# Altium schematic sheet milliohm-adapter.SchDoc
size A4; SheetNumber: 1; SheetTotal: 1
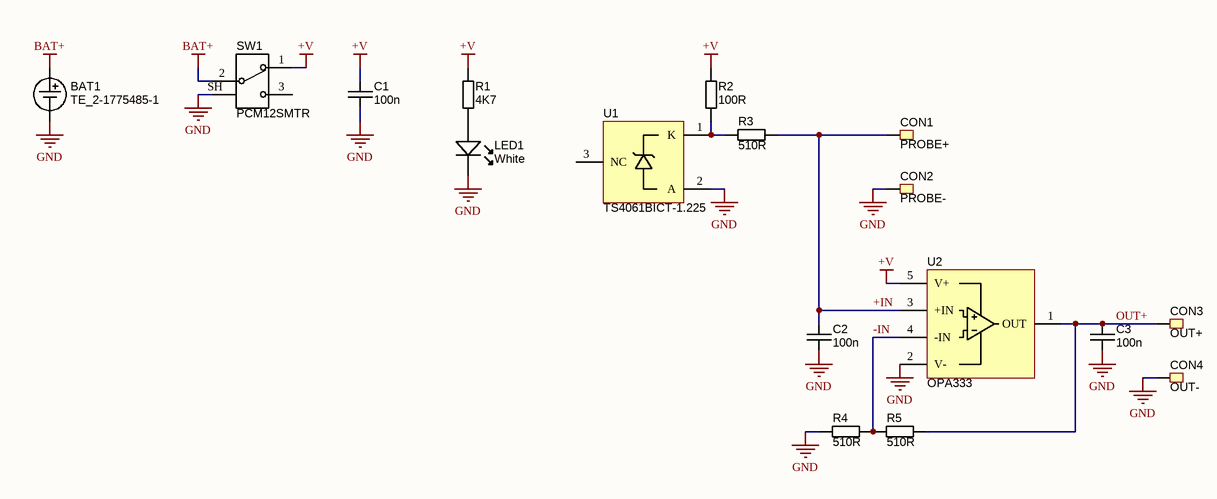
[diagram p0: milliohm-adapter.SchDoc]

## Parts
BAT1  TE_2-1775485-1  [TE_2-1775485-1]
C1  value 100n  [CAPC1608X90N]  (hidden comment: approved sub OK)
C2  value 100n  [CAPC1608X90N]  (hidden comment: approved sub OK)
C3  value 100n  [CAPC1608X90N]  (hidden comment: approved sub OK)
CON1  PROBE+  [AMASS-GC4010-F-THT]
CON2  PROBE-  [AMASS-GC4010-F-THT]
CON3  OUT+  [AMASS-GC4010-M-THT]
CON4  OUT-  [AMASS-GC4010-M-THT]
LED1  White  [LED-0603-WHITE]
R1  value 4K7  [RESC1608X55N]  (hidden comment: Thick Film)
R2  value 100R  [RESC1608X55N]  (hidden comment: Thick Film)
R3  value 510R  [RESC2012X70N]  (hidden comment: Thick Film)
R4  value 510R  [RESC2012X70N]  (hidden comment: Thick Film)
R5  value 510R  [RESC2012X70N]  (hidden comment: Thick Film)
SW1  PCM12SMTR  [PCM12SMTR]
U1  TS4061BICT-1.225  [TS4061_SOT323-3L]
U2  OPA333  [TI_DBV0005A_SOT23-5]

## Nets
+V: C1.1 R1.1 R2.2 SW1.1 U2.5(V+)
BAT+: BAT1.plus SW1.2
GND: BAT1.minus C1.2 C2.2 C3.2 CON2.1 CON4.1 LED1.K R4.2 SW1.SH U1.2(A) U2.2(V-)
+IN: C2.1 CON1.1 R3.1 U2.3(+IN)
-IN: R4.1 R5.2 U2.4(-IN)
OUT+: C3.1 CON3.1 R5.1 U2.1(OUT)
NetLED1_A: LED1.A R1.2
NetR2_1: R2.1 R3.2 U1.1(K)

Not connected (* = marked no-connect by the designer): SW1 3; U1 3(NC)

## Library data of the parts
C1-C3 = CAPC_100n_0603_X7R_50V_10%: Capacitor SMD Cer 100nF 10% 50V X7R 0603; Manufacturer 1: AVX Corporation; Manufacturer Part Number 1: 06035C104KAT2A; Ratings: 50V; X7R; Material: ceramic; SCDType: spec; Manufacturer 2: TDK Corporation; Manufacturer Part Number 2: C1608X7R1H104K; Package / Case: 0603 (1608 Metric); Tolerance: ±10%; Supplier 1: Digi-Key; Supplier Part Number 1: 478-5052-1-ND; ComponentLink1URL: http://www.avx.com/docs/Catalogs/cx7r.pdf; ComponentLink1Description: http://www.avx.com/docs/Catalogs/cx7r.pdf; Supplier 2: Digi-Key; Supplier Part Number 2: 445-1314-1-ND; ComponentLink2URL: http://product.tdk.com/capacitor/mlcc/en/documents/mlcc_commercial_general_en.pdf; ComponentLink2Description: http://product.tdk.com/capacitor/mlcc/en/documents/mlcc_commercial_general_en.pdf
CON1-CON4 = BULLET_4mm
LED1 = LED_SMD_White_0603_Bright: LED 0603 SMD Bright White 8700K; Manufacturer 1: Lite-On Inc; Manufacturer Part Number 1: LTW-C193TS5; Material: InGaN; Ratings: Ultra Bright; 8700K; Millicandela Rating: 230mcd; Voltage - Forward (Vf) Typ: 3.3V; Viewing Angle: 120°; Lens Type: Clear, Tinted; Lens Style/Size: Rectangle with Flat Top, 0.8mm x 1.1mm; Voltage - Forward (Vf) @ 10mA: 3.0V; SCDType: source; Package / Case: 0603 (1608 metric); Supplier 1: Digi-Key; Supplier Part Number 1: 160-1721-1-ND; Supplier 2: Digi-Key; Supplier Part Number 2: APT1608QWF/D-ND; Manufacturer 2: Kingbright Corp; Manufacturer Part Number 2: APT1608QWF/D; Color: White; Size / Dimension: 1.60mm L x 0.80mm W; Mounting Type: Surface Mount; Luminous Flux @ Current - Test: -; ComponentLink2URL: http://www.kingbrightusa.com/images/catalog/SPEC/APT1608QWF-D.pdf; ComponentLink2Description: http://www.kingbrightusa.com/images/catalog/SPEC/APT1608QWF-D.pdf; ComponentLink1URL: http://media.digikey.com/pdf/Data%20Sheets/Lite-On%20PDFs/LTW-C193TS5.pdf; ComponentLink1Description: http://media.digikey.com/pdf/Data%20Sheets/Lite-On%20PDFs/LTW-C193TS5.pdf
R1 = RES_4K7_0603_5%: Resistor SMD chip 4.7k Ohm 0.1W 5% 0603; Manufacturer 1: Vishay/Dale; Manufacturer Part Number 1: CRCW06034K70JNEA; Ratings: 1/10 W; SCDType: spec; Package / Case: 0603 (1608 metric); Tolerance: ±5%; Material: Thick Film; Supplier 1: Digi-Key; Supplier Part Number 1: 541-4.7KGCT-ND
R2 = RES_100R_0603_1%: Resistor SMD chip 100 Ohm 0.1W 1% 0603; Manufacturer 1: Yageo; Manufacturer Part Number 1: RC0603FR-07100RL; Ratings: 1/10 W; SCDType: spec; Package / Case: 0603 (1608 Metric); Material: Thick Film; Supplier 1: Digi-Key; Supplier Part Number 1: 311-100HRCT-ND; Supplier 2: Digi-Key; Supplier Part Number 2: P100HTR-ND; Manufacturer 2: Panasonic - ECG; Manufacturer Part Number 2: ERJ-3EKF1000V; ComponentLink1URL: http://industrial.panasonic.com/www-cgi/jvcr13pz.cgi?E+PZ+3+AOA0002+ERJ3EKF1000V+7+WW; ComponentLink1Description: http://industrial.panasonic.com/www-cgi/jvcr13pz.cgi?E+PZ+3+AOA0002+ERJ3EKF1000V+7+WW; Tolerance: ±1%
R3-R5 = RES_510R_0805_1%: Resistor SMD chip 510 Ohm 0.125W 1% 0805; Manufacturer 1: Yageo; Manufacturer Part Number 1: RC0805FR-07510RL; Ratings: 1/8 W; SCDType: spec; Package / Case: 0805 (2012 Metric); Material: Thick Film; Supplier 1: Digi-Key; Supplier Part Number 1: 311-510CRCT-ND; Tolerance: ±1%